# Altium schematic sheet DC unit.SchDoc
size 420 x 297 mm; Author: AzekClark; CompanyName: AzekClark; Address1: Address1; Address2: Address2; Address3: Address3; Address4: Address4; DocumentNumber: StaitsLED; SheetNumber: 2; SheetTotal: 4; Scale: 1:1; DocumentType: Схема электрическая принципиальная; FirstReferrence: StaitsLED
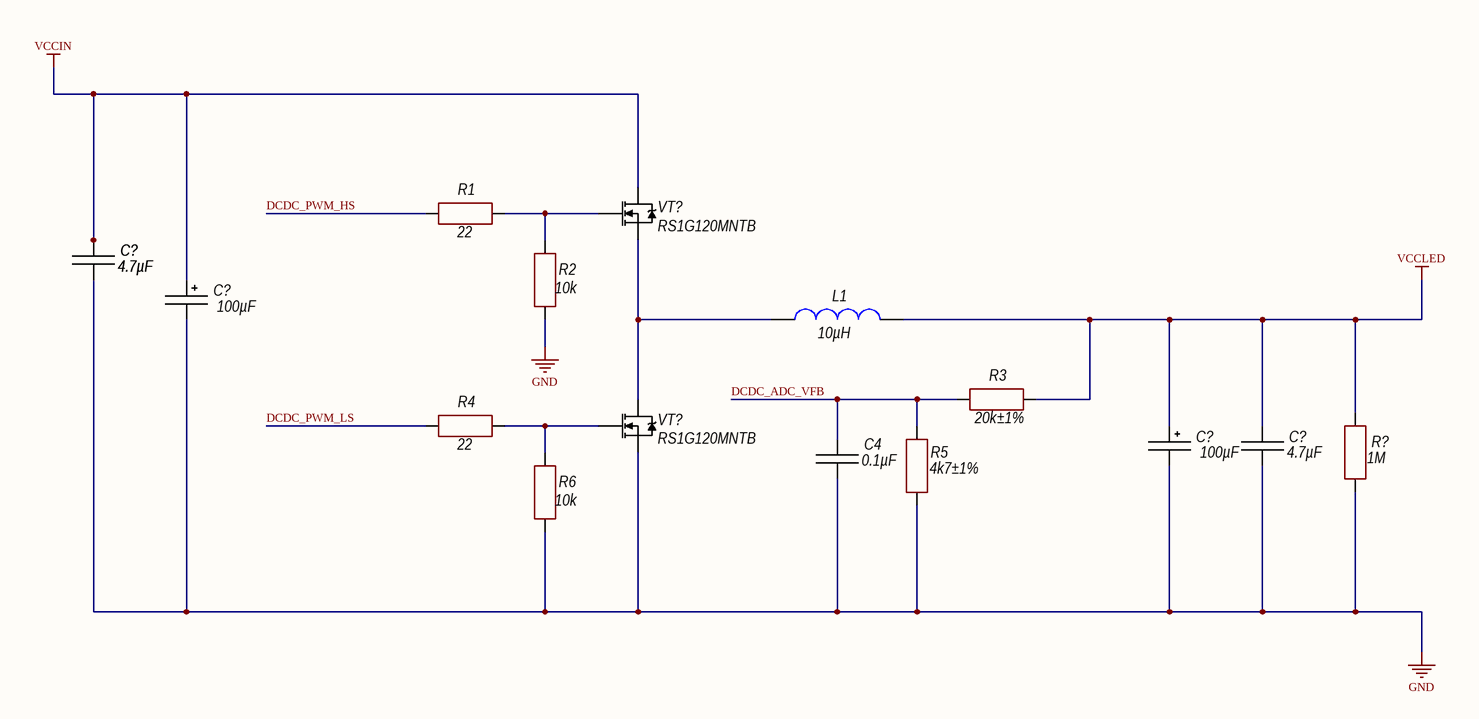
[diagram p0: DC unit.SchDoc]

## Parts
(Parts that share a designator on the sheet are numbered #1, #2 ... from top to bottom, then left to right.)
C4  0.1µF  [CH0603C]
C?#1  4.7µF  [CH1206C]
C?#2  4.7µF  [CH1206C]
C?#3  100µF  [D6.3C2.5H11]
C?#4  100µF  [D6.3C2.5H11]
C?#5  4.7µF  [CH1206C]
L1  10µH  [IND: CDRH127]
R1  22  [CH0603R]
R2  10k  [CH0603R]
R3  20k  ComponentKind: ±1%  [CH0603R]
R4  22  [CH0603R]
R5  4k7  ComponentKind: ±1%  [CH0603R]
R6  10k  [CH0603R]
R?  1M  [CH1206R]
VT?#1  RS1G120MNTB  [8-TDSON]
VT?#2  RS1G120MNTB  [8-TDSON]

## Nets
GND: C4.2 C?#1.1 C?#2.1 C?#3.2 C?#4.2 C?#5.1 R2.1 R5.1 R6.1 R?.1 VT?#2.3(S)
VCCIN: C?#1.2 C?#2.2 C?#3.1 VT?#1.2(D)
VCCLED: C?#4.1 C?#5.2 L1.1 R3.2 R?.2
DCDC_ADC_VFB: C4.1 R3.1 R5.2
DCDC_PWM_HS: R1.1
DCDC_PWM_LS: R4.1
NetL1_2: L1.2 VT?#1.3(S) VT?#2.2(D)
NetR1_2: R1.2 R2.2 VT?#1.1(G)
NetR4_2: R4.2 R6.2 VT?#2.1(G)

## Notes on the sheet
- Подп. и дата
- Инв. № дубл.
- Взам. инв. №
- Инв. № подл.
- Изм.
- Лист
- № докум.
- Подп.
- Дата
- 2.106-A3
- Копировал
- Формат А3

## Library data of the parts
C4 = Capacitor: Manufacturer: *; Model: *; HelpURL: *; ComponentKind: *; Value: 0.1µF
C?#1 C?#2 C?#5 = Capacitor: Manufacturer: Murata; Model: GRM31CR71H475KA12; HelpURL: https://www.chipdip.ru/product/grm31cr71h475ka12l; ComponentKind: 50V, X7R; Value: 4.7µF
C?#3 C?#4 = AlumCap: Manufacturer: BURNON; Model: -; HelpURL: https://www.chipdip.ru/product0/8001594426; ComponentKind: 35V; Value: 100µF
L1 = Inductor: Manufacturer: Sumida Electric; Model: SCDS127T-100M-N; HelpURL: https://www.chipdip.ru/product0/9000523882; ComponentKind: 5.4A; Value: 10µH
R1-R6 R? = Resistor: Manufacturer: *; Model: *; HelpURL: *
  R1 R4: ComponentKind: *; Value: 22
  R2 R6: ComponentKind: *; Value: 10k
  R3: Value: 20k
  R5: Value: 4k7
  R?: ComponentKind: *; Value: 1M
VT?#1 VT?#2 = N-chanel: Mosfet; Manufacturer: Rohm; Model: RS1G120MNTB; ComponentKind: 40V, 13A, 61mOm; HelpURL: https://www.rohm.com/datasheet/RQ3L050GN/rq3l050gntb-e